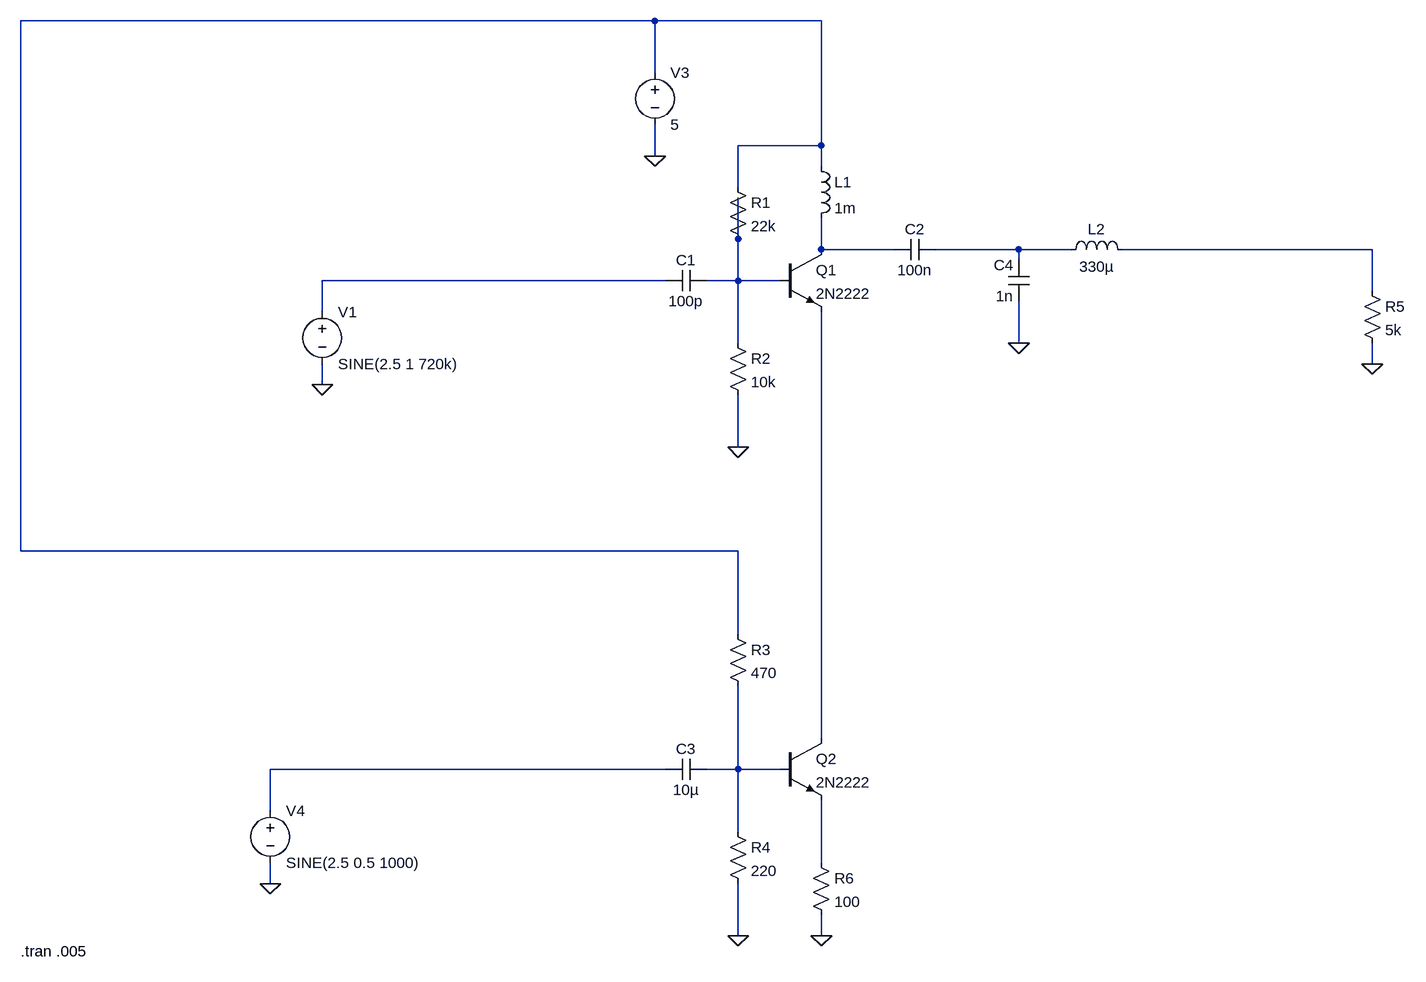
[diagram p0: schematic Cascode-AM-modulator.asc]
Cascode-AM-modulator.asc, the LTspice schematic file:
Version 4.1
SHEET 1 2760 1192
WIRE 480 -256 -496 -256
WIRE 736 -256 480 -256
WIRE 480 -176 480 -256
WIRE 736 -64 736 -256
WIRE 736 -64 608 -64
WIRE 480 -48 480 -96
WIRE 736 -32 736 -64
WIRE 608 0 608 -64
WIRE 608 80 608 16
WIRE 736 96 736 48
WIRE 848 96 736 96
WIRE 1040 96 912 96
WIRE 1120 96 1040 96
WIRE 1584 96 1200 96
WIRE 1040 112 1040 96
WIRE 496 144 -32 144
WIRE 608 144 608 80
WIRE 608 144 560 144
WIRE 672 144 608 144
WIRE 1584 160 1584 96
WIRE -32 192 -32 144
WIRE 608 240 608 144
WIRE 1040 240 1040 176
WIRE 1584 272 1584 240
WIRE -32 304 -32 272
WIRE 608 400 608 320
WIRE -496 560 -496 -256
WIRE 608 560 -496 560
WIRE 608 688 608 560
WIRE 736 848 736 192
WIRE 496 896 -112 896
WIRE 608 896 608 768
WIRE 608 896 560 896
WIRE 672 896 608 896
WIRE -112 960 -112 896
WIRE 608 992 608 896
WIRE 736 1040 736 944
WIRE -112 1072 -112 1040
WIRE 608 1152 608 1072
WIRE 736 1152 736 1120
FLAG 480 -48 0
FLAG 608 400 0
FLAG 1584 272 0
FLAG 608 1152 0
FLAG -112 1072 0
FLAG -32 304 0
FLAG 736 1152 0
FLAG 1040 240 0
SYMBOL npn 672 96 R0
SYMATTR InstName Q1
SYMATTR Value 2N2222
SYMBOL voltage 480 -192 R0
WINDOW 123 0 0 Left 0
WINDOW 39 0 0 Left 0
SYMATTR InstName V3
SYMATTR Value 5
SYMBOL res 592 -16 R0
SYMATTR InstName R1
SYMATTR Value 22k
SYMATTR SpiceLine tol=1 pwr=1
SYMBOL res 592 224 R0
SYMATTR InstName R2
SYMATTR Value 10k
SYMATTR SpiceLine tol=1 pwr=1
SYMBOL cap 560 128 R90
WINDOW 0 0 32 VBottom 2
WINDOW 3 32 32 VTop 2
SYMATTR InstName C1
SYMATTR Value 100p
SYMATTR SpiceLine V=100
SYMBOL cap 912 80 R90
WINDOW 0 0 32 VBottom 2
WINDOW 3 32 32 VTop 2
SYMATTR InstName C2
SYMATTR Value 100n
SYMBOL res 1568 144 R0
SYMATTR InstName R5
SYMATTR Value 5k
SYMATTR SpiceLine tol=1 pwr=10
SYMBOL npn 672 848 R0
SYMATTR InstName Q2
SYMATTR Value 2N2222
SYMBOL res 592 672 R0
SYMATTR InstName R3
SYMATTR Value 470
SYMATTR SpiceLine tol=1 pwr=1
SYMBOL res 592 976 R0
SYMATTR InstName R4
SYMATTR Value 220
SYMATTR SpiceLine tol=1 pwr=1
SYMBOL cap 560 880 R90
WINDOW 0 0 32 VBottom 2
WINDOW 3 32 32 VTop 2
SYMATTR InstName C3
SYMATTR Value 10µ
SYMATTR SpiceLine V=100
SYMBOL voltage -112 944 R0
WINDOW 123 0 0 Left 0
WINDOW 39 0 0 Left 0
SYMATTR InstName V4
SYMATTR Value SINE(2.5 0.5 1000)
SYMBOL voltage -32 176 R0
WINDOW 123 0 0 Left 0
WINDOW 39 0 0 Left 0
SYMATTR InstName V1
SYMATTR Value SINE(2.5 1 720k)
SYMBOL res 720 1024 R0
SYMATTR InstName R6
SYMATTR Value 100
SYMATTR SpiceLine tol=1 pwr=10
SYMBOL ind 720 -48 R0
SYMATTR InstName L1
SYMATTR Value 1m
SYMATTR SpiceLine Rser=1m
SYMBOL ind 1104 112 R270
WINDOW 0 32 56 VTop 2
WINDOW 3 5 56 VBottom 2
SYMATTR InstName L2
SYMATTR Value 330µ
SYMATTR SpiceLine Rser=1m
SYMBOL cap 1056 176 R180
WINDOW 0 24 56 Left 2
WINDOW 3 24 8 Left 2
SYMATTR InstName C4
SYMATTR Value 1n
SYMATTR SpiceLine V=100
TEXT -496 1176 Left 2 !.tran .005

The netlist it stands for:
* Cascode-AM-modulator.asc
Q1 N003 N002 N007 0 2N2222
V3 N001 0 5
R1 N001 N002 22k tol=1 pwr=1
R2 N002 0 10k tol=1 pwr=1
C1 N002 N006 100p V=100
C2 N004 N003 100n
R5 N005 0 5k tol=1 pwr=10
Q2 N007 N009 N010 0 2N2222
R3 N001 N009 470 tol=1 pwr=1
R4 N009 0 220 tol=1 pwr=1
C3 N009 N008 10µ V=100
V4 N008 0 SINE(2.5 0.5 1000)
V1 N006 0 SINE(2.5 1 720k)
R6 N010 0 100 tol=1 pwr=10
L1 N001 N003 1m Rser=1m
L2 N004 N005 330µ Rser=1m
C4 0 N004 1n V=100
.model NPN NPN
.model PNP PNP
.lib standard.bjt
.tran .005
.backanno
.end